# Altium schematic sheet RX_Board.SchDoc (part 1 of 5)
size A2; SheetNumber: 1; SheetTotal: 1
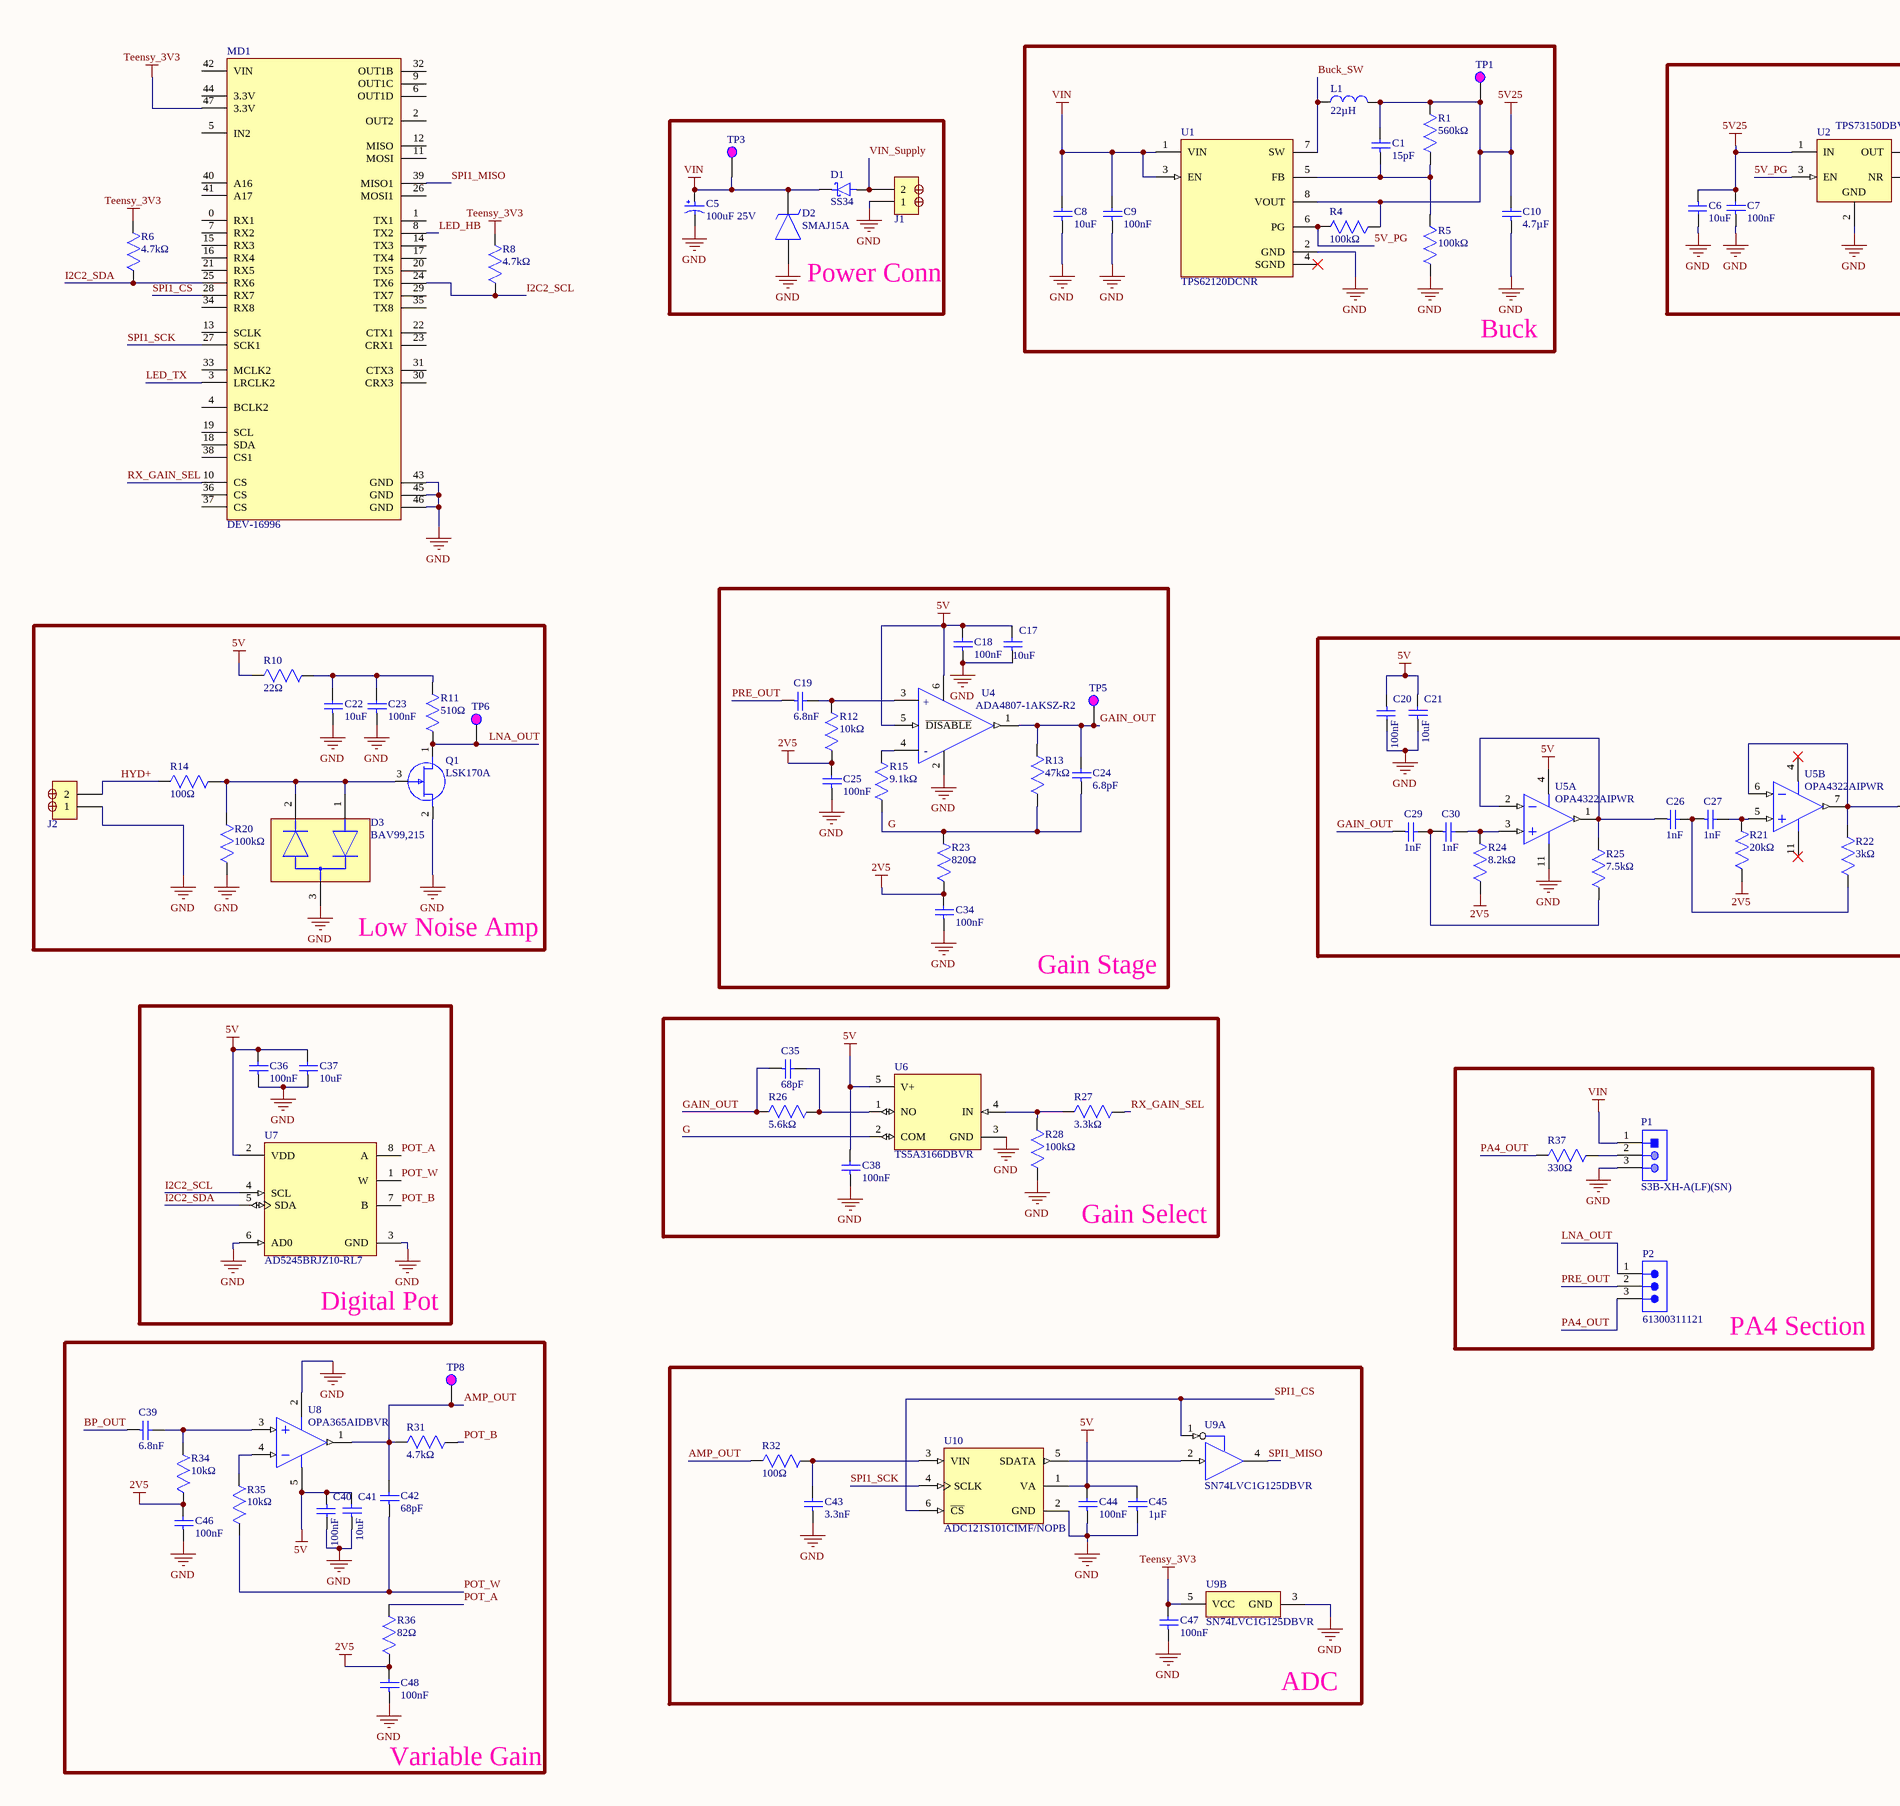
[diagram p0: RX_Board.SchDoc, left]
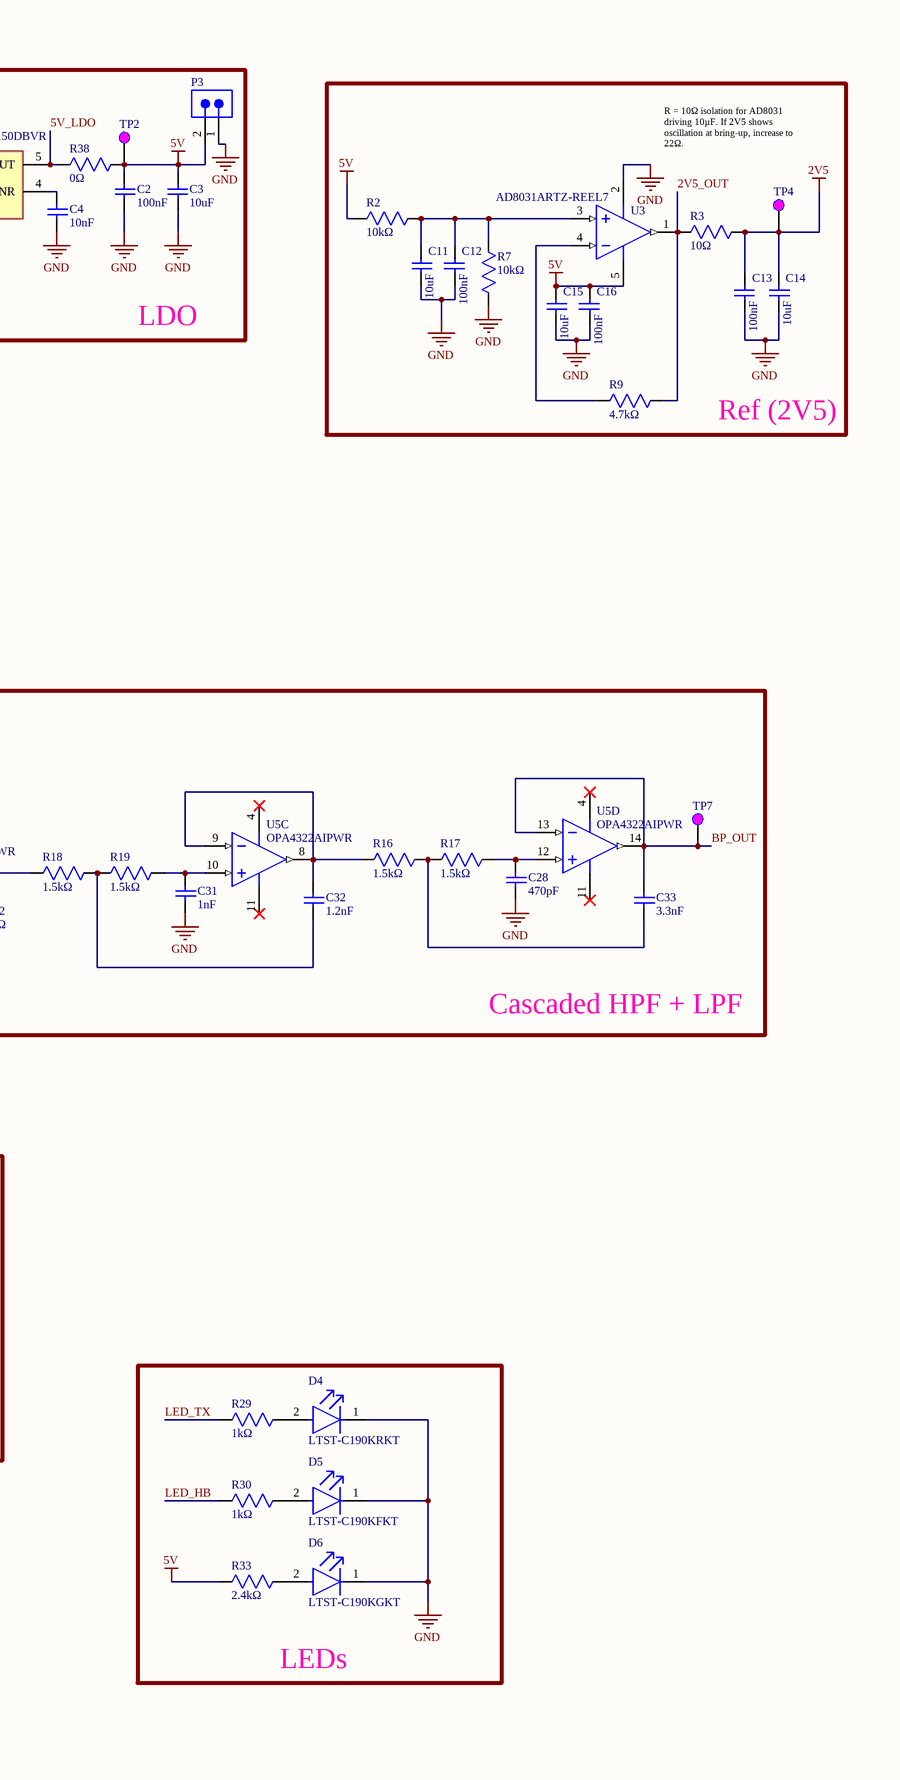
[diagram p1: RX_Board.SchDoc, right]

## Parts
C1  15pF  [CAP_0603]
C2  100nF  [CAP_0603]
C3  10uF  [CAP_0603]
C4  10nF  [CAP_0603]
C5  100uF 25V  [CAPAE660X800N]
C6  10uF  [CAP_0603]
C7  100nF  [CAP_0603]
C8  10uF  [CAP_0603]
C9  100nF  [CAP_0603]
C10  4.7µF  [CAP_0603]
C11  10uF  [CAP_0603]
C12  100nF  [CAP_0603]
C13  100nF  [CAP_0603]
C14  10uF  [CAP_0603]
C15  10uF  [CAP_0603]
C16  100nF  [CAP_0603]
C17  10uF  [CAP_0603]
C18  100nF  [CAP_0603]
C19  6.8nF  [CAP_0603]
C20  100nF  [CAP_0603]
C21  10uF  [CAP_0603]
C22  10uF  [CAP_0603]
C23  100nF  [CAP_0603]
C24  6.8pF  [CAP_0603]
C25  100nF  [CAP_0603]
C26  1nF  [CAP_0603]
C27  1nF  [CAP_0603]
C28  470pF  [CAP_0603]
C29  1nF  [CAP_0603]
C30  1nF  [CAP_0603]
C31  1nF  [CAP_0603]
C32  1.2nF  [CAP_0603]
C33  3.3nF  [CAP_0603]
C34  100nF  [CAP_0603]
C35  68pF  [CAP_0603]
C36  100nF  [CAP_0603]
C37  10uF  [CAP_0603]
C38  100nF  [CAP_0603]
C39  6.8nF  [CAP_0603]
C40  100nF  [CAP_0603]
C41  10uF  [CAP_0603]
C42  68pF  [CAP_0603]
C43  3.3nF  [CAP_0603]
C44  100nF  [CAP_0603]
C45  1µF  [CAP_0603]
C46  100nF  [CAP_0603]
C47  100nF  [CAP_0603]
C48  100nF  [CAP_0603]
D1  SS34  [SS34]
D2  SMAJ15A  [DIOM5026X229N]
D3  BAV99,215  [FP-SOT23-MFG]
D4  LTST-C190KRKT  [FP-LTST-C190KRKT-MFG]
D5  LTST-C190KFKT  [FP-LTST-C190KFKT-MFG]
D6  LTST-C190KGKT  [FP-LTST-C190KGKT-MFG]
J1  DB301V-3.5-2P-GN-S  [DB301V-3.5-2P-GN-S]  (value not drawn)
J2  DB301V-3.5-2P-GN-S  [DB301V-3.5-2P-GN-S]  (value not drawn)
L1  22µH  [SWPA5040S100MT]
MD1  DEV-16996  [FP-DEV-16996-MFG]
P1  S3B-XH-A(LF)(SN)  [JST-S3B-XH-A(LF)(SN)_V]
P2  61300311121  [61300311121]
P3  61300211121  [61300211121]  (value not drawn)
Q1  LSK170A  [SOT96P237X122-3N]
R1  560kΩ  [RES_0603]
R2  10kΩ  [RES_0603]
R3  10Ω  [RES_0603]
R4  100kΩ  [RES_0603]
R5  100kΩ  [RES_0603]
R6  4.7kΩ  [RES_0603]
R7  10kΩ  [RES_0603]
R8  4.7kΩ  [RES_0603]
R9  4.7kΩ  [RES_0603]
R10  22Ω  [RES_0603]
R11  510Ω  [RES_0603]
R12  10kΩ  [RES_0603]
R13  47kΩ  [RES_0603]
R14  100Ω  [RES_0603]
R15  9.1kΩ  [RES_0603]
R16  1.5kΩ  [RES_0603]
R17  1.5kΩ  [RES_0603]
R18  1.5kΩ  [RES_0603]
R19  1.5kΩ  [RES_0603]
R20  100kΩ  [RES_0603]
R21  20kΩ  [RES_0603]
R22  3kΩ  [RES_0603]
R23  820Ω  [RES_0603]
R24  8.2kΩ  [RES_0603]
R25  7.5kΩ  [RES_0603]
R26  5.6kΩ  [RES_0603]
R27  3.3kΩ  [RES_0603]
R28  100kΩ  [RES_0603]
R29  1kΩ  [RES_0603]
R30  1kΩ  [RES_0603]
R31  4.7kΩ  [RES_0603]
R32  100Ω  [RES_0603]
R33  2.4kΩ  [RES_0603]
R34  10kΩ  [RES_0603]
R35  10kΩ  [RES_0603]
R36  82Ω  [RES_0603]
R37  330Ω  [RES_0603]
R38  0Ω  [RES_0603]
TP1  Test Point  [Test Point]  (value not drawn)
TP2  Test Point  [Test Point]  (value not drawn)
TP3  Test Point  [Test Point]  (value not drawn)
TP4  Test Point  [Test Point]  (value not drawn)
TP5  Test Point  [Test Point]  (value not drawn)
TP6  Test Point  [Test Point]  (value not drawn)
TP7  Test Point  [Test Point]  (value not drawn)
TP8  Test Point  [Test Point]  (value not drawn)
U1  TPS62120DCNR  [FP-DCN0008A-MFG]
U2  TPS73150DBVR  [DBV0005A_N]
U3  AD8031ARTZ-REEL7  [ADI-RJ-5_L]
U4  ADA4807-1AKSZ-R2  [FP-KS-6-IPC_C]
U5  OPA4322AIPWR  [PW0014A_N]  (parts A,B,C,D of 4)
U6  TS5A3166DBVR  [FP-DBV0005A-MFG]
U7  AD5245BRJZ10-RL7  [FP-RJ-8-IPC_B]
U8  OPA365AIDBVR  [DBV0005A_N]
U9  SN74LVC1G125DBVR  [DBV0005A_M]  (parts A,B of 2)
U10  ADC121S101CIMF/NOPB  [MF06A_N]

## Blocks framed on the sheet
Buck: C1 C8-C10 L1 R1 R4 R5 TP1 U1
LDO: C2-C4 C6 C7 P3 R38 TP2 U2
Ref (2V5): C11-C16 R2 R3 R7 R9 TP4 U3
Power Conn: C5 D1 D2 J1 TP3
Low Noise Amp: C22 C23 D3 J2 Q1 R10 R11 R14 R20 TP6
Gain Stage: C17-C19 C24 C25 C34 R12 R13 R15 R23 TP5 U4
Cascaded HPF + LPF: C20 C21 C26-C33 R16-R19 R21 R22 R24 R25 TP7 U5
Digital Pot: C36 C37 U7
Gain Select: C35 C38 R26-R28 U6
PA4 Section: P1 P2 R37
LEDs: D4-D6 R29 R30 R33
Variable Gain: C39-C42 C46 C48 R31 R34-R36 TP8 U8
ADC: C43-C45 C47 R32 U9 U10

## Nets
2V5: C13.1 C14.2 C25.2 C34.2 C46.2 C48.2 R3.2 R12.1 R21.1 R23.1 R24.1 R34.2 R36.1 TP4.1
5V: C2.2 C3.1 C15.2 C16.1 C17.2 C18.2 C20.1 C21.2 C36.2 C37.2 C38.2 C40.1 C41.2 C44.2 C45.2 P3.2 R2.2 R10.1 R33.1 R38.2 TP2.1 U3.5(+VS) U4.5(~{DISABLE}) U4.6(+VS) U5.4(V+) U6.5(V+) U7.2(VDD) U8.5(V+) U10.1(VA)
5V25: C1.2 C6.1 C7.2 C10.2 L1.2 R1.2 R4.1 TP1.1 U1.8(VOUT) U2.1(IN)
GND: C2.1 C3.2 C4.1 C5.2(-) C6.2 C7.1 C8.1 C9.1 C10.1 C11.1 C12.2 C13.2 C14.1 C15.1 C16.2 C17.1 C18.1 C20.2 C21.1 C22.1 C23.1 C25.1 C28.1 C31.1 C34.1 C36.1 C37.1 C38.1 C40.2 C41.1 C43.1 C44.1 C45.1 C46.1 C47.1 C48.1 D2.2(A) D3.3 D4.1(C) D5.1(C) D6.1(C) J1.1 J2.1 MD1.43(GND) MD1.45(GND) MD1.46(GND) P1.3 P3.1 Q1.2(S) R5.1 R7.2 R20.1 R28.1 U1.2(GND) U2.2(GND) U3.2(-VS) U4.2(-VS) U5.11(V-) U6.3(GND) U7.3(GND) U7.6(AD0) U8.2(V-) U9.3(GND) U10.2(GND)
Teensy_3V3: C47.2 MD1.47(3.3V) R6.2 R8.2 U9.5(VCC)
VIN: C5.1(+) C8.2 C9.2 D1.K D2.1(K) P1.1 TP3.1 U1.1(VIN) U1.3(EN)
2V5_OUT: R3.1 R9.2 U3.1(VOUT)
5V_LDO: R38.1 U2.5(OUT)
5V_PG: R4.2 U1.6(PG) U2.3(EN)
AMP_OUT: C42.2 R31.1 R32.1 TP8.1 U8.1(VOUT)
BP_OUT: C33.2 C39.1 TP7.1 U5.13(IN_D-) U5.14(OUT_D)
Buck_SW: L1.1 U1.7(SW)
G: C24.1 R13.1 R15.1 R23.2 U6.2(COM)
GAIN_OUT: C24.2 C29.1 C35.1 R13.2 R26.1 TP5.1 U4.1(VOUT)
HYD+: J2.2 R14.1
I2C2_SCL: MD1.24(TX6) R8.1 U7.4(SCL)
I2C2_SDA: MD1.25(RX6) R6.1 U7.5(SDA)
LED_HB: MD1.8(TX2) R30.1
LED_TX: MD1.3(LRCLK2) R29.1
LNA_OUT: P2.1 Q1.1(D) R11.1 TP6.1
PA4_OUT: P2.3 R37.1
POT_A: R36.2 U7.8(A)
POT_B: R31.2 U7.7(B)
POT_W: C42.1 R35.2 U7.1(W)
PRE_OUT: C19.1 P2.2
RX_GAIN_SEL: MD1.10(CS) R27.2
SPI1_CS: MD1.28(RX7) U9.1(~{OE}) U10.6(~{CS})
SPI1_MISO: MD1.39(MISO1) U9.4(Y)
SPI1_SCK: MD1.27(SCK1) U10.4(SCLK)
VIN_Supply: D1.A J1.2
NetC1_1: C1.1 R1.1 R5.2 U1.5(FB)
NetC4_2: C4.2 U2.4(NR)
NetC11_2: C11.2 C12.1 R2.1 R7.1 U3.3(+IN)
NetC19_2: C19.2 R12.2 U4.3(+IN)
NetC22_2: C22.2 C23.2 R10.2 R11.2
NetC26_1: C26.1 R25.2 U5.1(OUT_A) U5.2(IN_A-)
NetC26_2: C26.2 C27.1 R22.1
NetC27_2: C27.2 R21.2 U5.5(IN_B+)
NetC28_2: C28.2 R17.2 U5.12(IN_D+)
NetC29_2: C29.2 C30.1 R25.1
NetC30_2: C30.2 R24.2 U5.3(IN_A+)
NetC31_2: C31.2 R19.2 U5.10(IN_C+)
NetC32_1: C32.1 R18.2 R19.1
NetC32_2: C32.2 R16.1 U5.8(OUT_C) U5.9(IN_C-)
NetC33_1: C33.1 R16.2 R17.1
NetC35_2: C35.2 R26.2 U6.1(NO)
NetC39_2: C39.2 R34.1 U8.3(IN+)
NetC43_2: C43.2 R32.2 U10.3(VIN)
NetD3_1: D3.1 D3.2 Q1.3(G) R14.2 R20.2
NetD4_2: D4.2(A) R29.2
NetD5_2: D5.2(A) R30.2
NetD6_2: D6.2(A) R33.2
NetP1_2: P1.2 R37.2
NetR9_1: R9.1 U3.4(-IN)
NetR15_2: R15.2 U4.4(-IN)
NetR18_1: R18.1 R22.2 U5.6(IN_B-) U5.7(OUT_B)
NetR27_1: R27.1 R28.2 U6.4(IN)
NetR35_1: R35.1 U8.4(IN-)
NetU9_2: U9.2(A) U10.5(SDATA)

Not connected (* = marked no-connect by the designer): MD1 0(RX1) 1(TX1) 2(OUT2) 4(BCLK2) 5(IN2) 6(OUT1D) 7(RX2) 9(OUT1C) 11(MOSI) 12(MISO) 13(SCLK) 14(TX3) 15(RX3) 16(RX4) 17(TX4) 18(SDA) 19(SCL) 20(TX5) 21(RX5) 22(CTX1) 23(CRX1) 26(MOSI1) 29(TX7) 30(CRX3) 31(CTX3) 32(OUT1B) 33(MCLK2) 34(RX8) 35(TX8) 36(CS) 37(CS) 38(CS1) 40(A16) 41(A17) 42(VIN) 44(3.3V); U1 4(SGND)*

## Notes on the sheet
- R = 10Ω isolation for AD8031 driving 10µF. If 2V5 shows oscillation at bring-up, increase to 22Ω.
- (in symbol CMP-09116-000031-1) +; -